# Altium schematic sheet OperacionesLogicasSchmatic.SchDoc
size Letter; Organization: Altium Limited; Address1: L3, 12a Rodborough Rd; Address2: Frenchs Forest; Address3: NSW; Address4: Australia 2086
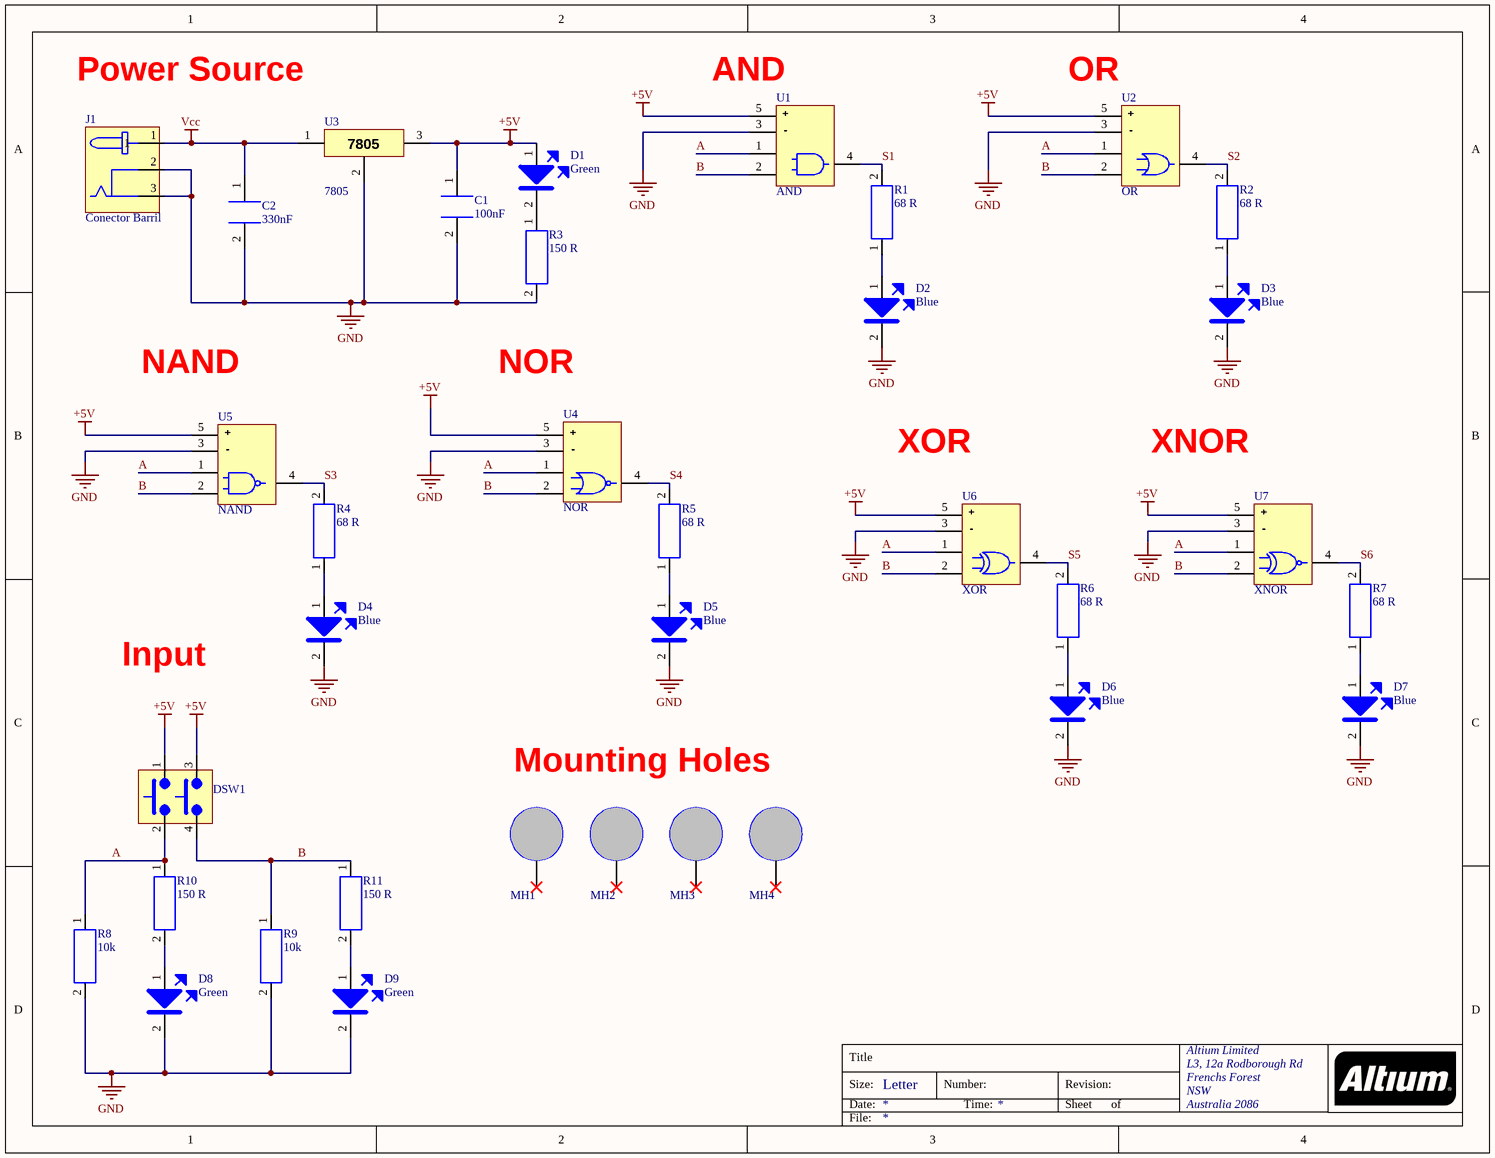
[diagram p0: OperacionesLogicasSchmatic.SchDoc]

## Parts
C1  100nF  [Capacitor0805]
C2  330nF  [Capacitor0805]
D1  Green  [Led0603]
D2  Blue  [LedTHBlue]
D3  Blue  [LedTHBlue]
D4  Blue  [LedTHBlue]
D5  Blue  [LedTHBlue]
D6  Blue  [LedTHBlue]
D7  Blue  [LedTHBlue]
D8  Green  [LedTHGreen]
D9  Green  [LedTHGreen]
DSW1  DIP switch 2 pos  [DipSwitch_1x02]  (value not drawn)
J1  Conector Barril  [JackConector]
MH1  Mounting Hole  [MH]  (value not drawn)
MH2  Mounting Hole  [MH]  (value not drawn)
MH3  Mounting Hole  [MH]  (value not drawn)
MH4  Mounting Hole  [MH]  (value not drawn)
R1  68 R  [Resistor0805]
R2  68 R  [Resistor0805]
R3  150 R  [Resistor0805]
R4  68 R  [Resistor0805]
R5  68 R  [Resistor0805]
R6  68 R  [Resistor0805]
R7  68 R  [Resistor0805]
R8  10k  [Resistor0805]
R9  10k  [Resistor0805]
R10  150 R  [Resistor0805]
R11  150 R  [Resistor0805]
U1  AND  [DCK_SC_70_5]
U2  OR  [DCK_SC_70_5]
U3  7805  [T0-236]
U4  NOR  [DCK_SC_70_5]
U5  NAND  [DCK_SC_70_5]
U6  XOR  [DCK_SC_70_5]
U7  XNOR  [DCK_SC_70_5]

## Nets
+5V: C1.1 D1.1(A) DSW1.1 DSW1.3 U1.5(VCC) U2.5(VCC) U3.3 U4.5(VCC) U5.5(VCC) U6.5(VCC) U7.5(VCC)
GND: C1.2 C2.2 D2.2(C) D3.2(C) D4.2(C) D5.2(C) D6.2(C) D7.2(C) D8.2(C) D9.2(C) J1.2 J1.3 R3.2 R8.2 R9.2 U1.3(GND) U2.3(GND) U3.2 U4.3(GND) U5.3(GND) U6.3(GND) U7.3(GND)
Vcc: C2.1 J1.1 U3.1
A: DSW1.2 R8.1 R10.1 U1.1(A) U2.1(A) U4.1(A) U5.1(A) U6.1(A) U7.1(A)
B: DSW1.4 R9.1 R11.1 U1.2(B) U2.2(B) U4.2(B) U5.2(B) U6.2(B) U7.2(B)
S1: R1.2 U1.4(Y)
S2: R2.2 U2.4(Y)
S3: R4.2 U5.4(Y)
S4: R5.2 U4.4(Y)
S5: R6.2 U6.4(Y)
S6: R7.2 U7.4(Y)
NetD1_2: D1.2(C) R3.1
NetD2_1: D2.1(A) R1.1
NetD3_1: D3.1(A) R2.1
NetD4_1: D4.1(A) R4.1
NetD5_1: D5.1(A) R5.1
NetD6_1: D6.1(A) R6.1
NetD7_1: D7.1(A) R7.1
NetD8_1: D8.1(A) R10.2
NetD9_1: D9.1(A) R11.2

Not connected (* = marked no-connect by the designer): MH1 1*; MH2 1*; MH3 1*; MH4 1*

## Notes on the sheet
- Power Source
- (near U1) AND
- (near U2) OR
- (near U5) NAND
- NOR
- (near U6) XOR
- XNOR
- Input
- Mounting Holes
- Title
- Size:
- Date:
- Letter
- Number:
- Time:
- Revision:
- Sheet
- of
- File:
- (in symbol SN74AHCT1G08DCKR) +; -
- (in symbol SN74AUP1T87DCKR) +; -
- (in symbol SN74LVC1G00DCKR) +; -
- (in symbol SN74LVC1G02MDCKREP) +; -
- (in symbol SN74LVC1G32DCKR) +; -
- (in symbol SN74LVC1G86DCKR) +; -

## Library data of the parts
C1 = C0805C104K4RACTU: KEMET - C0805C104K4RACTU - SMD Multilayer Ceramic Capacitor, 0.1 µF, 16 V, 0805 [2012 Metric], ± 10%, X7R, C Series KEMET; Voltage Rating: 16V; Supplier 1: Avnet; Supplier Part Number 1: C0805C104K4RACTU; Manufacturer: KEMET; Manufacturer Part Number: C0805C104K4RACTU; Stock 1: 12000; Pricing 1: 4000=0.0363, 8000=0.035, 16000=0.034, 24000=0.0333, 32000=0.032 (USD); Mount: Surface Mount,PCB; Case/Package: 0805; Number of Pins: 2; Case Code (Imperial): 0805; Case Code (Metric): 2012; Contact Plating: Tin,Matte; Dielectric Material: Ceramic; Min Operating Temperature: -55°C; Max Operating Temperature: 125°C; Capacitance: 100nF; Packaging: Tape and Reel; Package Quantity: 1; Tolerance: 10%; Voltage Rating (DC): 16V; Dielectric: X7R; Termination: SMD/SMT; Voltage: 16V; Length: 2mm; Height: 0.9mm; Width: 0.049inch; Lead Pitch: 0.75mm; Thickness: 0.035inch; Depth: 1.25mm; Radiation Hardening: No; REACH SVHC: No SVHC; ComponentLink1URL: http://www.farnell.com/datasheets/2741062.pdf?src-supplier=Element14; ComponentLink1Description: http://www.farnell.com/datasheets/2741062.pdf?src-supplier=Element14
C2 = CC0805JKX7R7BB334: CAP CER 0.33UF 16V X7R 0805; Manufacturer: Yageo; Material: Ceramic; Tolerance: 5%; Supplier 1: Avnet; Supplier Part Number 1: CC0805JKX7R7BB334; Manufacturer Part Number: CC0805JKX7R7BB334; Stock 1: 0; Pricing 1: 3000=0.0246, 6000=0.0243, 12000=0.0236, 18000=0.0231, 24000=0.0222 (USD); Mount: Surface Mount; Case/Package: 0805; Min Operating Temperature: -55°C; Max Operating Temperature: 125°C; Voltage Rating: 16V; Capacitance: 330nF; Packaging: Tape and Reel; Dielectric: X7R; Voltage Rating (DC): 16V; Voltage: 16V; Length: 2mm; Width: 0.049inch; Thickness: 0.057inch; Depth: 1.25mm; Radiation Hardening: No; Lead Free: Lead Free; Halogen Free: Halogen Free; ComponentLink1URL: https://www.verical.com/server-webapp/html/getDatasheet?partID=403645&src-supplier=Verical; ComponentLink1Description: https://www.verical.com/server-webapp/html/getDatasheet?partID=403645&src-supplier=Verical
D1 = LTST-C191GKT: LED GREEN CLEAR 0603 SMD; Manufacturer: Vishay Lite-On; Lens Color: Colorless; Viewing Angle: 130°; Lens Style: Clear,Diffused,Colorless,Rectangular; Forward Voltage: 2.1V; Luminous Intensity: 12mcd; Forward Current: 30mA; Dominant Wavelength: 569nm; Test Current: 20mA; Wavelength: 565nm; Number of LEDs: 1; Reverse Voltage: 5V; Power Dissipation: 100mW; Supplier 1: Avnet; Supplier Part Number 1: LTST-C191GKT; Manufacturer Part Number: LTST-C191GKT; Stock 1: 0; Pricing 1: 5000=0.037, 10000=0.0361, 20000=0.0344, 30000=0.0334, 40000=0.0327 (USD); Mount: Surface Mount; Case/Package: 0603; Number of Pins: 2; Color: Green; Case Code (Metric): 1608; Case Code (Imperial): 0603; Min Operating Temperature: -55°C; Max Operating Temperature: 85°C; Package Quantity: 1; Illumination Color: Green; Packaging: Tape and Reel; Lens Transparency: Clear; Number of Elements: 1; Power Rating: 100mW; Length: 1.6mm; Height: 0.55mm; Width: 0.8mm; Depth: 0.8mm; Radiation Hardening: No; Lead Free: Lead Free; ComponentLink1URL: http://www1.futureelectronics.com/doc/LITE%20ON/LITE-ON%20LTST-C191GKT.pdf?src-supplier=Future+Electronics; ComponentLink1Description: http://www1.futureelectronics.com/doc/LITE%20ON/LITE-ON%20LTST-C191GKT.pdf?src-supplier=Future+Electronics; ComponentLink2URL: http://www.mouser.com/ds/2/239/liteon_ltst-c191gkt-371200.pdf?src-supplier=Mouser; ComponentLink2Description: http://www.mouser.com/ds/2/239/liteon_ltst-c191gkt-371200.pdf?src-supplier=Mouser; ComponentLink3URL: https://media.digikey.com/pdf/Data%20Sheets/Lite-On%20PDFs/LTST-C191GKT.pdf?src-supplier=Digi-Key; ComponentLink3Description: https://media.digikey.com/pdf/Data%20Sheets/Lite-On%20PDFs/LTST-C191GKT.pdf?src-supplier=Digi-Key
D2-D7 = C503B-BCN-CV0Z0462: Standard LEDs - Through Hole 30DG BL NOSTNDOF HI BRT LAMP 470NM 3.2V; Manufacturer: Cree; Lens Color: Colorless; Luminous Intensity: 7065mcd; Lens Style: Dome,Round; Viewing Angle: 30°; Forward Current: 20mA; Lens Transparency: Clear; Number of Elements: 1; Power Dissipation: 120mW; Reverse Voltage: 5V; Supplier 1: Avnet; Supplier Part Number 1: 08R2921; Manufacturer Part Number: C503B-BCN-CV0Z0462; Stock 1: 0; Pricing 1: 1=0.21, 10=0.196, 100=0.179, 500=0.171, 1000=0.162 (USD); Mount: Through Hole; Case/Package: Radial; Number of Pins: 2; Color: Blue; Min Operating Temperature: -40°C; Max Operating Temperature: 95°C; Illumination Color: Blue; Forward Voltage: 3.2V; Wavelength: 470nm; Package Quantity: 2500; Packaging: Tape and Reel; Test Current: 20mA; Dominant Wavelength: 470nm; Number of LEDs: 1; Length: 5.8mm; Height: 10.3mm; Depth: 5.8mm; REACH SVHC: Unknown; ComponentLink1URL: http://www.farnell.com/datasheets/1758062.pdf?src-supplier=Element14; ComponentLink1Description: http://www.farnell.com/datasheets/1758062.pdf?src-supplier=Element14; ComponentLink2URL: http://www.cree.com/~/media/Files/Cree/LED%20Components%20and%20Modules/HB/Data%20Sheets/C503B%20BAS%20BAN%20BCS%20BCN%20GAS%20GAN%20GCS%20GCN%201094.pdf?src-supplier=Digi-Key; ComponentLink2Description: http://www.cree.com/~/media/Files/Cree/LED%20Components%20and%20Modules/HB/Data%20Sheets/C503B%20BAS%20BAN%20BCS%20BCN%20GAS%20GAN%20GCS%20GCN%201094.pdf?src-supplier=Digi-Key
D8 D9 = C5SMF-RJF-CT0W0BB1: LED RED CLEAR 5MM OVAL T/H; Manufacturer: Cree; Forward Current: 20mA; Forward Voltage: 2.1V; Luminous Intensity: 2640mcd; Lens Style: Elliptical; Viewing Angle: 40°; Dominant Wavelength: 621nm; Supplier 1: Avnet; Supplier Part Number 1: 45W7905; Manufacturer Part Number: C5SMF-RJF-CT0W0BB1; Stock 1: 0; Pricing 1: 1=0.144, 10=0.144, 30=0.144, 50=0.144, 100=0.144 (USD); Mount: Through Hole; Case/Package: Radial; Color: Red; Lens Color: Red; Min Operating Temperature: -40°C; Max Operating Temperature: 95°C; Package Quantity: 500; Packaging: Bulk; Illumination Color: Red; Lens Transparency: Clear; Test Current: 20mA; Height: 10.95mm; ComponentLink1URL: http://www.cree.com/led-components/media/documents/C5SMF-RJF-RJE-GJF-GJE-BJF-BJE-1240.pdf?src-supplier=Digi-Key; ComponentLink1Description: http://www.cree.com/led-components/media/documents/C5SMF-RJF-RJE-GJF-GJE-BJF-BJE-1240.pdf?src-supplier=Digi-Key
DSW1 = A6T-2104: Slide Switch,STRAIGHT,DPST,ON-OFF,Number Of Positions:2,PC TAIL Terminal,PCB Hole Count:4; Manufacturer: Omron; Mechanical Life: 1000Cycles; Voltage Rating (DC): 24V; Throw Configuration: SPST; Max Current Rating: 25mA; Number of Positions: 2; Actuator Type: Slide (Standard); Contact Resistance: 200mR; Pitch: 0.1inch; Actuator Length: 0.6mm; Washable: No; Supplier 1: Avnet; Supplier Part Number 1: A6T2104; Manufacturer Part Number: A6T-2104; Stock 1: 0; Pricing 1: 76=0.9571, 152=0.9269, 304=0.8834, 456=0.8585, 608=0.8274 (USD); Mount: Through Hole,PCB; Case/Package: DIP; Weight: 0.26g; Contact Plating: Gold; Contact Material: Gold; Min Operating Temperature: -20°C; Max Operating Temperature: 70°C; Package Quantity: 76; Packaging: Rail/Tube; Current Rating: 25mA; Termination: PC Pins; Electrical Life: 1000Cycles; Orientation: Straight; Contact Current Rating: 25mA; Max Voltage Rating (DC): 24V; Number of Circuits: 2; Length: 0.237inch; Height: 4.2mm; Width: 6.2mm; Terminal Pitch: 2.54mm; Radiation Hardening: No; Lead Free: Lead Free; REACH SVHC: Unknown; ComponentLink1URL: http://www.omron.com/ecb/products/pdf/en-a6t.pdf?src-supplier=Digi-Key; ComponentLink1Description: http://www.omron.com/ecb/products/pdf/en-a6t.pdf?src-supplier=Digi-Key; ComponentLink2URL: http://www.farnell.com/datasheets/54384.pdf?src-supplier=Element14; ComponentLink2Description: http://www.farnell.com/datasheets/54384.pdf?src-supplier=Element14; ComponentLink3URL: http://www.mouser.com/ds/2/307/A6T_1110-10807.pdf?src-supplier=Mouser; ComponentLink3Description: http://www.mouser.com/ds/2/307/A6T_1110-10807.pdf?src-supplier=Mouser
J1 = KLDX-0202-A: Conn Power PIN 2 POS Solder RA Thru-Hole 3 Terminal 1 Port; Manufacturer: Kycon; Number of Contacts: 2; Current Rating: 3.5A; Voltage Rating: 24V; Gender: Female; Insulation Resistance: 100MR; Supplier 1: Avnet; Supplier Part Number 1: KLDX-0202-A; Manufacturer Part Number: KLDX-0202-A; Stock 1: 0; Mount: Through Hole; Contact Plating: Tin; Color: Black; Contact Material: Brass; Housing Material: PBT; Min Operating Temperature: -25°C; Max Operating Temperature: 85°C; Package Quantity: 500; Termination: Solder; Orientation: Right Angle; Packaging: Bag; Contact Gender: Female; Connector Type: Power; Voltage Rating (DC): 24V; Radiation Hardening: No; Flammability Rating: UL94 V-0
MH1-MH4 = MountingHole
R1 R2 R4-R7 = ERA-8AEB680V: RES SMD 68 OHM 0.1% 1/4W 1206; Manufacturer: Panasonic; Resistance: 68R; Temperature Coefficient: 25ppm/°C; Power Rating: 250mW; Voltage Rating: 300V; Supplier 1: Avnet; Supplier Part Number 1: ERA-8AEB680V; Manufacturer Part Number: ERA-8AEB680V; Stock 1: 0; Pricing 1: 5000=0.1506, 10000=0.1475, 20000=0.1455, 30000=0.1413, 40000=0.1382 (USD); Mount: Surface Mount; Case/Package: 1206; Number of Pins: 2; Weight: 0.000571oz; Contact Plating: Tin; Case Code (Imperial): 1206; Case Code (Metric): 3216; Min Operating Temperature: -55°C; Max Operating Temperature: 155°C; Tolerance: 0.1%; Composition: Metal Film,Thin Film; Package Quantity: 5000; Packaging: Tape and Reel; Termination: SMD/SMT; Number of Terminations: 2; Military Standard: Not; Max Power Dissipation: 250mW; Voltage Rating (DC): 300V; Length: 3.2mm; Height: 0.6mm; Width: 1.6mm; Depth: 1.6mm; Radiation Hardening: No; REACH SVHC: No SVHC; Lead Free: Lead Free; ComponentLink1URL: http://industrial.panasonic.com/www-data/pdf/AOA0000/AOA0000CE26.pdf?src-supplier=Avnet+Europe; ComponentLink1Description: http://industrial.panasonic.com/www-data/pdf/AOA0000/AOA0000CE26.pdf?src-supplier=Avnet+Europe; ComponentLink2URL: http://www.farnell.com/datasheets/391390.pdf?src-supplier=Element14; ComponentLink2Description: http://www.farnell.com/datasheets/391390.pdf?src-supplier=Element14; ComponentLink3URL: http://industrial.panasonic.com/www-data/pdf/AOA0000/AOA0000CE26.pdf?src-supplier=Avnet; ComponentLink3Description: http://industrial.panasonic.com/www-data/pdf/AOA0000/AOA0000CE26.pdf?src-supplier=Avnet; ComponentLink4URL: https://www.distrelec.biz/Web/Downloads/_t/ds/ERA_eng_tds.pdf?mime=application%2Fpdf&src-supplier=Distrelec; ComponentLink4Description: https://www.distrelec.biz/Web/Downloads/_t/ds/ERA_eng_tds.pdf?mime=application%2Fpdf&src-supplier=Distrelec
R3 R10 R11 = RC0805JR-07150RL (2): YAGEO (PHYCOMP)   RC0805JR-07150RL   Surface Mount Chip Resistor, Thick Film, RC Series, 150 ohm, 125 mW,  5%, 150 V; Resistance: 150R; Temperature Coefficient: 100ppm/°C; Power Rating: 125mW; Voltage Rating: 150V; Supplier 1: Avnet; Supplier Part Number 1: RC0805JR-07150RL; Manufacturer: Yageo; Manufacturer Part Number: RC0805JR-07150RL; Stock 1: 0; Pricing 1: 5000=0.0021, 10000=0.002, 20000=0.002, 30000=0.0019, 40000=0.0018 (USD); Case/Package: 0805; Contact Plating: Tin,Matte,Lead; Case Code (Imperial): 0805; Case Code (Metric): 2012; Min Operating Temperature: -55°C; Max Operating Temperature: 155°C; Tolerance: 5%; Composition: Thick Film; Packaging: Tape and Reel; Termination: SMD/SMT; Radiation Hardening: No; REACH SVHC: Unknown; Lead Free: Lead Free; ComponentLink1URL: http://www.farnell.com/datasheets/444164.pdf?src-supplier=Element14; ComponentLink1Description: http://www.farnell.com/datasheets/444164.pdf?src-supplier=Element14; ComponentLink2URL: http://www.farnell.com/datasheets/442941.pdf?src-supplier=Element14; ComponentLink2Description: http://www.farnell.com/datasheets/442941.pdf?src-supplier=Element14
R8 R9 = RNCP0805FTD10K0: RES 10K OHM 1% 1/4W 0805; Manufacturer: Stackpole Electronics; Resistance: 10kR; Max Power Dissipation: 250mW; Temperature Coefficient: 100ppm/°C; Supplier 1: Avnet; Supplier Part Number 1: RNCP0805FTD10K0; Manufacturer Part Number: RNCP0805FTD10K0; Stock 1: 0; Pricing 1: 5000=0.0068, 10000=0.0067, 20000=0.0065, 30000=0.0064, 40000=0.0061 (USD); Mount: Surface Mount; Case/Package: 0805; Case Code (Metric): 2012; Case Code (Imperial): 0805; Min Operating Temperature: -55°C; Max Operating Temperature: 155°C; Tolerance: 1%; Packaging: Tape and Reel; Composition: Thin Film; Number of Terminations: 2; Features: Moisture Resistant,Anti-Sulfur; Length: 0.079inch; Height: 0.024inch; Width: 0.049inch; Lead Free: Lead Free; ComponentLink1URL: https://www.seielect.com/catalog/SEI-Packaging.pdf?src-supplier=Digi-Key; ComponentLink1Description: https://www.seielect.com/catalog/SEI-Packaging.pdf?src-supplier=Digi-Key
U1 = SN74AHCT1G08DCKR: IC GATE AND 1CH 2-INP SC70-5; Manufacturer: Texas Instruments; Max Supply Voltage: 5.5V; Min Supply Voltage: 4.5V; Operating Supply Voltage: 5V; Propagation Delay: 7.9ns; Number of Outputs: 1; Number of Inputs: 2; Output Current: 8mA; Quiescent Current: 1uA; High Level Output Current: -8mA; Turn-On Delay Time: 9ns; Schmitt Trigger Input: No; Supplier 1: Avnet; Supplier Part Number 1: SN74AHCT1G08DCKR; Manufacturer Part Number: SN74AHCT1G08DCKR; Stock 1: 0; Pricing 1: 9000=0.0434, 15000=0.0417, 24000=0.0398, 45000=0.0386, 90000=0.0372 (USD); Mount: Surface Mount; Case/Package: SC; Number of Pins: 5; Weight: 8.8E-05oz; Contact Plating: Gold; Min Operating Temperature: -40°C; Max Operating Temperature: 125°C; Logic Function: AND; Packaging: Tape and Reel; Package Quantity: 3000; Number of Elements: 1; Number of Gates: 1; Number of Input Lines: 2; Number of Output Lines: 1; Low Level Output Current: 8mA; Number of Circuits: 1; Number of Bits: 1; Max Output Current: 8mA; Termination: SMD/SMT; Length: 2mm; Height: 0.9mm; Width: 1.25mm; Radiation Hardening: No; REACH SVHC: No SVHC; Lead Free: Lead Free; ComponentLink1URL: http://www.farnell.com/datasheets/1834083.pdf?src-supplier=Element14; ComponentLink1Description: http://www.farnell.com/datasheets/1834083.pdf?src-supplier=Element14; ComponentLink2URL: http://www.farnell.com/datasheets/1763941.pdf?src-supplier=Element14; ComponentLink2Description: http://www.farnell.com/datasheets/1763941.pdf?src-supplier=Element14; ComponentLink3URL: http://www.farnell.com/datasheets/1882756.pdf?src-supplier=Element14; ComponentLink3Description: http://www.farnell.com/datasheets/1882756.pdf?src-supplier=Element14; ComponentLink4URL: http://www.ti.com/lit/ds/symlink/sn74ahct1g08.pdf?src-supplier=Digi-Key; ComponentLink4Description: http://www.ti.com/lit/ds/symlink/sn74ahct1g08.pdf?src-supplier=Digi-Key
U2 = SN74LVC1G32DCKR: IC GATE OR 1CH 2-INP SC70-5; Manufacturer: Texas Instruments; Min Supply Voltage: 1.65V; Max Supply Voltage: 5.5V; Quiescent Current: 10uA; Output Current: 32mA; Number of Inputs: 2; Propagation Delay: 4ns; Number of Elements: 1; High Level Output Current: -32mA; Turn-On Delay Time: 4.5ns; Schmitt Trigger Input: No; Supplier 1: Avnet; Supplier Part Number 1: SN74LVC1G32DCKR; Manufacturer Part Number: SN74LVC1G32DCKR; Stock 1: 0; Pricing 1: 3000=0.0341, 6000=0.0328, 12000=0.0312, 18000=0.0304, 24000=0.0293 (USD); Mount: Surface Mount; Case/Package: SC; Number of Pins: 5; Weight: 8.8E-05oz; Contact Plating: Gold; Min Operating Temperature: -40°C; Max Operating Temperature: 125°C; Logic Function: OR; Package Quantity: 1; Packaging: Tape and Reel; Number of Outputs: 1; Number of Circuits: 1; Low Level Output Current: 32mA; Number of Gates: 1; Number of Input Lines: 2; Number of Output Lines: 1; Number of Bits: 1; Max Output Current: 32mA; Termination: SMD/SMT; Length: 2mm; Height: 0.9mm; Width: 1.25mm; Radiation Hardening: No; REACH SVHC: No SVHC; Lead Free: Lead Free; ComponentLink1URL: http://www.ti.com/lit/ds/symlink/sn74lvc1g32.pdf?src-supplier=Digi-Key; ComponentLink1Description: http://www.ti.com/lit/ds/symlink/sn74lvc1g32.pdf?src-supplier=Digi-Key; ComponentLink2URL: http://www.ti.com/general/docs/lit/getliterature.tsp?genericPartNumber=SN74LVC1G32&amp;&amp;fileType=pdf&src-supplier=Farnell; ComponentLink2Description: http://www.ti.com/general/docs/lit/getliterature.tsp?genericPartNumber=SN74LVC1G32&amp;&amp;fileType=pdf&src-supplier=Farnell; ComponentLink3URL: https://www.verical.com/server-webapp/html/getDatasheet?partID=127914&src-supplier=Verical; ComponentLink3Description: https://www.verical.com/server-webapp/html/getDatasheet?partID=127914&src-supplier=Verical; ComponentLink4URL: http://www.jameco.com/Jameco/Products/ProdDS/756781.pdf?src-supplier=Jameco; ComponentLink4Description: http://www.jameco.com/Jameco/Products/ProdDS/756781.pdf?src-supplier=Jameco; ComponentLink5URL: http://www.ti.com/general/docs/lit/getliterature.tsp?genericPartNumber=SN74LVC1G32&amp;&amp;fileType=pdf&src-supplier=Avnet+Asia; ComponentLink5Description: http://www.ti.com/general/docs/lit/getliterature.tsp?genericPartNumber=SN74LVC1G32&amp;&amp;fileType=pdf&src-supplier=Avnet+Asia; ComponentLink6URL: http://www.farnell.com/datasheets/1768050.pdf?src-supplier=Element14; ComponentLink6Description: http://www.farnell.com/datasheets/1768050.pdf?src-supplier=Element14; ComponentLink7URL: http://www.ti.com/general/docs/lit/getliterature.tsp?genericPartNumber=SN74LVC1G32&&fileType=pdf&src-supplier=Avnet; ComponentLink7Description: http://www.ti.com/general/docs/lit/getliterature.tsp?genericPartNumber=SN74LVC1G32&&fileType=pdf&src-supplier=Avnet; ComponentLink8URL: http://focus.ti.com/lit/ds/symlink/sn74lvc1g32.pdf?src-supplier=Avnet+Europe; ComponentLink8Description: http://focus.ti.com/lit/ds/symlink/sn74lvc1g32.pdf?src-supplier=Avnet+Europe
U3 = UA7805CKTTR: LDO Regulator Pos 5V 1.5A 4-Pin(3+Tab) TO-263 T/R; Manufacturer: Texas Instruments; Number of Outputs: 1; Min Input Voltage: 7V; Max Input Voltage: 25V; Output Type: Fixed; Polarity: Positive; Quiescent Current: 8mA; Dropout Voltage: 2V; Max Output Voltage: 5.2V; Min Output Voltage: 4.8V; Power Rating: 15W; Power Supply Rejection Ratio (PSRR): 78dB; Supplier 1: Avnet; Supplier Part Number 1: UA7805CKTTR; Manufacturer Part Number: UA7805CKTTR; Stock 1: 0; Pricing 1: 1000=0.3875, 2000=0.3725, 3000=0.355, 5000=0.345, 10000=0.3325 (USD); Mount: Surface Mount; Case/Package: TO-263; Number of Pins: 3; Weight: 0.050897oz; Contact Plating: Tin,Matte; Min Operating Temperature: 0°C; Max Operating Temperature: 125°C; Max Output Current: 1.5A; Output Voltage: 5V; Output Current: 1.5A; Packaging: Tape and Reel; Package Quantity: 1; Nominal Output Voltage: 5V; Number of Regulators: 1; Length: 10.67mm; Height: 4.83mm; Width: 9.65mm; Radiation Hardening: No; Lead Free: Lead Free; REACH SVHC: No SVHC; ComponentLink1URL: http://www.farnell.com/datasheets/1882245.pdf?src-supplier=Element14; ComponentLink1Description: http://www.farnell.com/datasheets/1882245.pdf?src-supplier=Element14; ComponentLink2URL: http://www.ti.com/lit/ds/symlink/ua78.pdf?src-supplier=Digi-Key; ComponentLink2Description: http://www.ti.com/lit/ds/symlink/ua78.pdf?src-supplier=Digi-Key; ComponentLink3URL: http://www.farnell.com/datasheets/1994325.pdf?src-supplier=Element14; ComponentLink3Description: http://www.farnell.com/datasheets/1994325.pdf?src-supplier=Element14; ComponentLink4URL: http://www.ti.com/general/docs/lit/getliterature.tsp?genericPartNumber=UA7812&&fileType=pdf&src-supplier=Avnet; ComponentLink4Description: http://www.ti.com/general/docs/lit/getliterature.tsp?genericPartNumber=UA7812&&fileType=pdf&src-supplier=Avnet
U4 = SN74LVC1G02MDCKREP: Enhanced Product Single 2-Input Positive-Nor Gate 5-SC70 -55 to 125; Manufacturer: Texas Instruments; Min Supply Voltage: 1.65V; Max Supply Voltage: 5.5V; Quiescent Current: 10uA; Output Current: 32mA; Number of Inputs: 2; Propagation Delay: 5ns; Number of Circuits: 1; High Level Output Current: -32mA; Turn-On Delay Time: 6ns; Supplier 1: Avnet; Supplier Part Number 1: SN74LVC1G02MDCKREP; Manufacturer Part Number: SN74LVC1G02MDCKREP; Stock 1: 0; Pricing 1: 3000=0.8727, 6000=0.8389, 12000=0.7995, 18000=0.7769, 24000=0.7488 (USD); Mount: Surface Mount; Case/Package: SC; Number of Pins: 5; Weight: 8.8E-05oz; Min Operating Temperature: -55°C; Max Operating Temperature: 125°C; Logic Function: NOR; Package Quantity: 1; Packaging: Tape and Reel; Low Level Output Current: 32mA; Number of Gates: 1; Number of Elements: 1; Number of Bits: 1; Number of Outputs: 1; Number of Input Lines: 2; Number of Output Lines: 1; Radiation Hardening: No; REACH SVHC: No SVHC; Lead Free: Lead Free; ComponentLink1URL: http://www.ti.com/general/docs/lit/getliterature.tsp?genericPartNumber=SN74LVC1G02-EP&&fileType=pdf&src-supplier=Avnet; ComponentLink1Description: http://www.ti.com/general/docs/lit/getliterature.tsp?genericPartNumber=SN74LVC1G02-EP&&fileType=pdf&src-supplier=Avnet; ComponentLink2URL: http://www.ti.com/lit/ds/symlink/sn74lvc1g02-ep.pdf?src-supplier=Digi-Key; ComponentLink2Description: http://www.ti.com/lit/ds/symlink/sn74lvc1g02-ep.pdf?src-supplier=Digi-Key; ComponentLink3URL: http://focus.ti.com/lit/ds/symlink/sn74lvc1g02-ep.pdf?src-supplier=Avnet+Europe; ComponentLink3Description: http://focus.ti.com/lit/ds/symlink/sn74lvc1g02-ep.pdf?src-supplier=Avnet+Europe; ComponentLink4URL: http://www.produktinfo.conrad.com/datenblaetter/1000000-1099999/001073413-da-01-en-IC_SNGL_2_SN74LVC1G02MDCKREP_SC_70_5_TID.pdf?src-supplier=Conrad; ComponentLink4Description: http://www.produktinfo.conrad.com/datenblaetter/1000000-1099999/001073413-da-01-en-IC_SNGL_2_SN74LVC1G02MDCKREP_SC_70_5_TID.pdf?src-supplier=Conrad
U5 = SN74LVC1G00DCKR: TEXAS INSTRUMENTS         SN74LVC1G00DCKR            NAND Gate, LVC Family, 1 Gate, 2 Input, 32 mA, 1.65V to 5.5V, SC-70-5; Number of Inputs: 2; Propagation Delay: 4ns; Number of Outputs: 1; Low Level Output Current: 32mA; Quiescent Current: 10uA; High Level Output Current: -32mA; Turn-On Delay Time: 4.3ns; Schmitt Trigger Input: No; Operating Supply Voltage: 5V; Supplier 1: Avnet; Supplier Part Number 1: SN74LVC1G00DCKR; Manufacturer: Texas Instruments; Manufacturer Part Number: SN74LVC1G00DCKR; Stock 1: 0; Pricing 1: 3000=0.0341, 6000=0.0328, 12000=0.0312, 18000=0.0304, 24000=0.0293 (USD); Mount: Surface Mount; Case/Package: SC; Number of Pins: 5; Weight: 8.8E-05oz; Contact Plating: Gold; Min Operating Temperature: -40°C; Max Operating Temperature: 125°C; Logic Function: NAND; Min Supply Voltage: 1.65V; Max Supply Voltage: 5.5V; Packaging: Tape and Reel; Package Quantity: 1; Number of Gates: 1; Number of Input Lines: 2; Number of Output Lines: 1; Number of Circuits: 1; Number of Elements: 1; Number of Bits: 1; Output Current: 32mA; Max Output Current: 32mA; Termination: SMD/SMT; Length: 2mm; Height: 0.9mm; Width: 1.25mm; Radiation Hardening: No; Lead Free: Lead Free; REACH SVHC: No SVHC; ComponentLink1URL: http://www.farnell.com/datasheets/1887494.pdf?src-supplier=Element14; ComponentLink1Description: http://www.farnell.com/datasheets/1887494.pdf?src-supplier=Element14; ComponentLink2URL: http://www.jameco.com/Jameco/Products/ProdDS/1043571.pdf?src-supplier=Jameco; ComponentLink2Description: http://www.jameco.com/Jameco/Products/ProdDS/1043571.pdf?src-supplier=Jameco; ComponentLink3URL: http://www.ti.com/lit/ds/symlink/sn74lvc1g00.pdf?src-supplier=Digi-Key; ComponentLink3Description: http://www.ti.com/lit/ds/symlink/sn74lvc1g00.pdf?src-supplier=Digi-Key; ComponentLink4URL: http://www.ti.com/general/docs/lit/getliterature.tsp?genericPartNumber=SN74LVC1G00&&fileType=pdf&src-supplier=Avnet; ComponentLink4Description: http://www.ti.com/general/docs/lit/getliterature.tsp?genericPartNumber=SN74LVC1G00&&fileType=pdf&src-supplier=Avnet; ComponentLink5URL: https://www.verical.com/server-webapp/html/getDatasheet?partID=189925&src-supplier=Verical; ComponentLink5Description: https://www.verical.com/server-webapp/html/getDatasheet?partID=189925&src-supplier=Verical; ComponentLink6URL: http://www.produktinfo.conrad.com/datenblaetter/1000000-1099999/001075097-da-01-en-IC_NAND_GATE_2_SN74LVC1G00DCKR_SC_70_TID.pdf?src-supplier=Conrad; ComponentLink6Description: http://www.produktinfo.conrad.com/datenblaetter/1000000-1099999/001075097-da-01-en-IC_NAND_GATE_2_SN74LVC1G00DCKR_SC_70_TID.pdf?src-supplier=Conrad
U6 = SN74LVC1G86DCKR: TEXAS INSTRUMENTS - SN74LVC1G86DCKR - XOR Gate, 74LVC1G86, 2 Input, 32 mA, 1.65 V to 5.5 V, SC-70-5; Max Supply Voltage: 5.5V; Min Supply Voltage: 1.65V; Logic Function: XOR,OR; Quiescent Current: 10uA; Propagation Delay: 4ns; Number of Inputs: 2; Number of Circuits: 1; High Level Output Current: -32mA; Low Level Output Current: 32mA; Turn-On Delay Time: 5ns; Schmitt Trigger Input: No; Supplier 1: Avnet; Supplier Part Number 1: SN74LVC1G86DCKR; Manufacturer: Texas Instruments; Manufacturer Part Number: SN74LVC1G86DCKR; Stock 1: 0; Pricing 1: 12500=0.031, 13000=0.0298, 26000=0.0284, 63000=0.0276, 130000=0.0266 (USD); Mount: Surface Mount; Case/Package: SC; Number of Pins: 5; Weight: 8.8E-05oz; Contact Plating: Gold; Min Operating Temperature: -40°C; Max Operating Temperature: 125°C; Packaging: Tape and Reel; Package Quantity: 1; Number of Gates: 1; Number of Elements: 1; Number of Bits: 1; Number of Outputs: 1; Number of Input Lines: 2; Number of Output Lines: 1; Output Current: 32mA; Max Output Current: 32mA; Termination: SMD/SMT; Length: 2.15mm; Height: 1mm; Width: 1.4mm; Radiation Hardening: No; Lead Free: Lead Free; REACH SVHC: No SVHC; ComponentLink1URL: http://www.ti.com/lit/ds/symlink/sn74lvc1g86.pdf?src-supplier=Digi-Key; ComponentLink1Description: http://www.ti.com/lit/ds/symlink/sn74lvc1g86.pdf?src-supplier=Digi-Key; ComponentLink2URL: http://www.farnell.com/datasheets/1850935.pdf?src-supplier=Element14; ComponentLink2Description: http://www.farnell.com/datasheets/1850935.pdf?src-supplier=Element14; ComponentLink3URL: http://www.ti.com/general/docs/lit/getliterature.tsp?genericPartNumber=SN74LVC1G86&&fileType=pdf&src-supplier=Avnet; ComponentLink3Description: http://www.ti.com/general/docs/lit/getliterature.tsp?genericPartNumber=SN74LVC1G86&&fileType=pdf&src-supplier=Avnet; ComponentLink4URL: http://www.ti.com/general/docs/lit/getliterature.tsp?genericPartNumber=SN74LVC1G86&amp;&amp;fileType=pdf&src-supplier=Avnet+Asia; ComponentLink4Description: http://www.ti.com/general/docs/lit/getliterature.tsp?genericPartNumber=SN74LVC1G86&amp;&amp;fileType=pdf&src-supplier=Avnet+Asia
U7 = SN74AUP1T87DCKR: TEXAS INSTRUMENTS - SN74AUP1T87DCKR - LOGIC, XNOR GATE, SINGLE, SC-70-5; Min Supply Voltage: 2.3V; Max Supply Voltage: 3.6V; Propagation Delay: 4.4ns; Number of Inputs: 2; Number of Circuits: 1; Quiescent Current: 500nA; High Level Output Current: 4mA; Logic Function: NOR,XNOR; Nominal Supply Current: 900nA; Supplier 1: Avnet; Supplier Part Number 1: SN74AUP1T87DCKR; Manufacturer: Texas Instruments; Manufacturer Part Number: SN74AUP1T87DCKR; Stock 1: 0; Pricing 1: 6000=0.093, 12000=0.0894, 18000=0.0852, 30000=0.0828, 60000=0.0798 (USD); Mount: Surface Mount; Case/Package: SC; Number of Pins: 5; Min Operating Temperature: -40°C; Max Operating Temperature: 85°C; Packaging: Tape and Reel; Package Quantity: 1; Low Level Output Current: 4mA; Number of Elements: 1; Number of Gates: 1; Number of Bits: 1; Number of Outputs: 1; Output Current: 4mA; Radiation Hardening: No; Lead Free: Lead Free; REACH SVHC: No SVHC; ComponentLink1URL: http://focus.ti.com/lit/ds/symlink/sn74aup1t87.pdf?src-supplier=Avnet; ComponentLink1Description: http://focus.ti.com/lit/ds/symlink/sn74aup1t87.pdf?src-supplier=Avnet; ComponentLink2URL: http://www.ti.com/general/docs/lit/getliterature.tsp?genericPartNumber=SN74AUP1T87&&fileType=pdf&src-supplier=Avnet; ComponentLink2Description: http://www.ti.com/general/docs/lit/getliterature.tsp?genericPartNumber=SN74AUP1T87&&fileType=pdf&src-supplier=Avnet; ComponentLink3URL: http://www.farnell.com/datasheets/2020581.pdf?src-supplier=Element14; ComponentLink3Description: http://www.farnell.com/datasheets/2020581.pdf?src-supplier=Element14; ComponentLink4URL: http://www.ti.com/lit/ds/symlink/sn74aup1t87.pdf?src-supplier=Digi-Key; ComponentLink4Description: http://www.ti.com/lit/ds/symlink/sn74aup1t87.pdf?src-supplier=Digi-Key